# Altium schematic sheet CF_ADC.SchDoc
size Tabloid; DocumentNumber: 6; SheetNumber: 6; SheetTotal: 10; Sheet_Name: CF_ADC; Size: 11x17
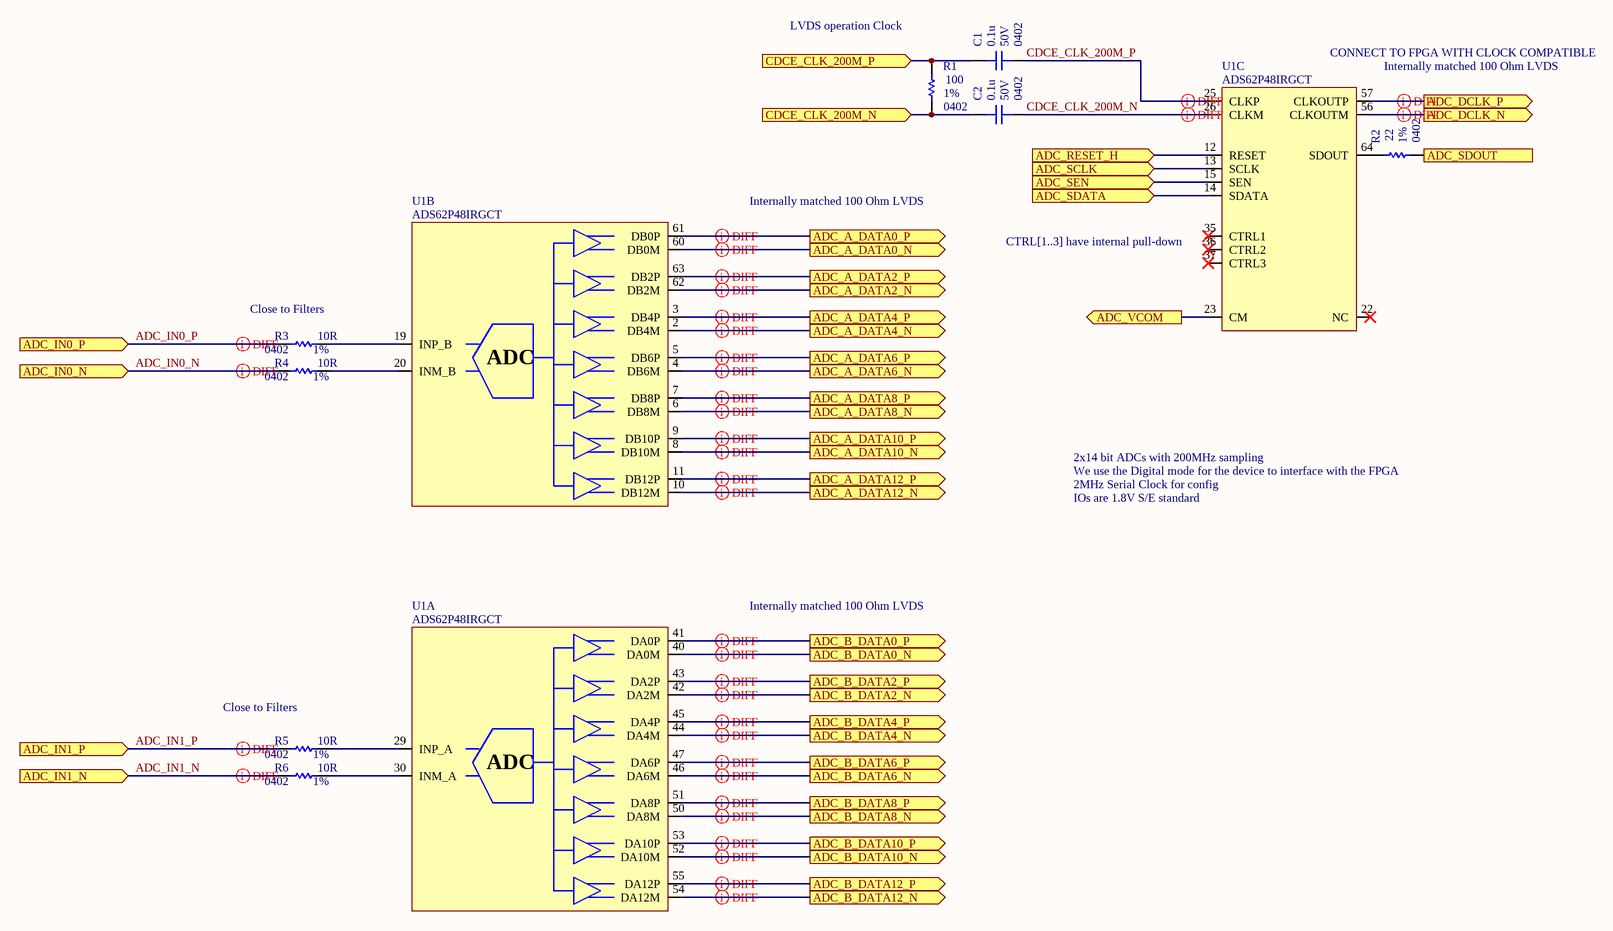
[diagram p0: CF_ADC.SchDoc]

## Parts
C1  value 0.1u  Voltage: 50V  Package: 0402  [CAP_0402]  (hidden comment: CAP - 0402)
C2  value 0.1u  Voltage: 50V  Package: 0402  [CAP_0402]  (hidden comment: CAP - 0402)
R1  value 100  Package: 0402  Precision: 1%  [RES_0402]  (hidden comment: RES - 0402)
R2  value 22  Package: 0402  Precision: 1%  [RES_0402]  (hidden comment: RES - 0402)
R3  value 10R  Package: 0402  Precision: 1%  [RES_0402]  (hidden comment: RES - 0402)
R4  value 10R  Package: 0402  Precision: 1%  [RES_0402]  (hidden comment: RES - 0402)
R5  value 10R  Package: 0402  Precision: 1%  [RES_0402]  (hidden comment: RES - 0402)
R6  value 10R  Package: 0402  Precision: 1%  [RES_0402]  (hidden comment: RES - 0402)
U1  ADS62P48IRGCT  [ADC_ADS62P48IRGCT]  (parts A,B,C of 4)

## Ports
ADC_A_DATA0_N (out), ADC_A_DATA0_P (out), ADC_A_DATA2_N (out), ADC_A_DATA2_P (out), ADC_A_DATA4_N (out), ADC_A_DATA4_P (out), ADC_A_DATA6_N (out), ADC_A_DATA6_P (out), ADC_A_DATA8_N (out), ADC_A_DATA8_P (out), ADC_A_DATA10_N (out), ADC_A_DATA10_P (out), ADC_A_DATA12_N (out), ADC_A_DATA12_P (out), ADC_B_DATA0_N (out), ADC_B_DATA0_P (out), ADC_B_DATA2_N (out), ADC_B_DATA2_P (out), ADC_B_DATA4_N (out), ADC_B_DATA4_P (out), ADC_B_DATA6_N (out), ADC_B_DATA6_P (out), ADC_B_DATA8_N (out), ADC_B_DATA8_P (out), ADC_B_DATA10_N (out), ADC_B_DATA10_P (out), ADC_B_DATA12_N (out), ADC_B_DATA12_P (out), ADC_DCLK_N (out), ADC_DCLK_P (out), ADC_IN0_N (in), ADC_IN0_P (in), ADC_IN1_N (in), ADC_IN1_P (in), ADC_RESET_H (in), ADC_SCLK (in), ADC_SDATA (in), ADC_SDOUT (out), ADC_SEN (in), ADC_VCOM (out), CDCE_CLK_200M_N (in), CDCE_CLK_200M_P (in)

## Nets
ADC_A_DATA0_N: U1.60(DB0M) ; port ADC_A_DATA0_N
ADC_A_DATA0_P: U1.61(DB0P) ; port ADC_A_DATA0_P
ADC_A_DATA2_N: U1.62(DB2M) ; port ADC_A_DATA2_N
ADC_A_DATA2_P: U1.63(DB2P) ; port ADC_A_DATA2_P
ADC_A_DATA4_N: U1.2(DB4M) ; port ADC_A_DATA4_N
ADC_A_DATA4_P: U1.3(DB4P) ; port ADC_A_DATA4_P
ADC_A_DATA6_N: U1.4(DB6M) ; port ADC_A_DATA6_N
ADC_A_DATA6_P: U1.5(DB6P) ; port ADC_A_DATA6_P
ADC_A_DATA8_N: U1.6(DB8M) ; port ADC_A_DATA8_N
ADC_A_DATA8_P: U1.7(DB8P) ; port ADC_A_DATA8_P
ADC_A_DATA10_N: U1.8(DB10M) ; port ADC_A_DATA10_N
ADC_A_DATA10_P: U1.9(DB10P) ; port ADC_A_DATA10_P
ADC_A_DATA12_N: U1.10(DB12M) ; port ADC_A_DATA12_N
ADC_A_DATA12_P: U1.11(DB12P) ; port ADC_A_DATA12_P
ADC_B_DATA0_N: U1.40(DA0M) ; port ADC_B_DATA0_N
ADC_B_DATA0_P: U1.41(DA0P) ; port ADC_B_DATA0_P
ADC_B_DATA2_N: U1.42(DA2M) ; port ADC_B_DATA2_N
ADC_B_DATA2_P: U1.43(DA2P) ; port ADC_B_DATA2_P
ADC_B_DATA4_N: U1.44(DA4M) ; port ADC_B_DATA4_N
ADC_B_DATA4_P: U1.45(DA4P) ; port ADC_B_DATA4_P
ADC_B_DATA6_N: U1.46(DA6M) ; port ADC_B_DATA6_N
ADC_B_DATA6_P: U1.47(DA6P) ; port ADC_B_DATA6_P
ADC_B_DATA8_N: U1.50(DA8M) ; port ADC_B_DATA8_N
ADC_B_DATA8_P: U1.51(DA8P) ; port ADC_B_DATA8_P
ADC_B_DATA10_N: U1.52(DA10M) ; port ADC_B_DATA10_N
ADC_B_DATA10_P: U1.53(DA10P) ; port ADC_B_DATA10_P
ADC_B_DATA12_N: U1.54(DA12M) ; port ADC_B_DATA12_N
ADC_B_DATA12_P: U1.55(DA12P) ; port ADC_B_DATA12_P
ADC_DCLK_N: U1.56(CLKOUTM) ; port ADC_DCLK_N
ADC_DCLK_P: U1.57(CLKOUTP) ; port ADC_DCLK_P
ADC_IN0_N: R4.2 ; port ADC_IN0_N
ADC_IN0_P: R3.2 ; port ADC_IN0_P
ADC_IN1_N: R6.2 ; port ADC_IN1_N
ADC_IN1_P: R5.2 ; port ADC_IN1_P
ADC_RESET_H: U1.12(RESET) ; port ADC_RESET_H
ADC_SCLK: U1.13(SCLK) ; port ADC_SCLK
ADC_SDATA: U1.14(SDATA) ; port ADC_SDATA
ADC_SDOUT: R2.1 ; port ADC_SDOUT
ADC_SEN: U1.15(SEN) ; port ADC_SEN
ADC_VCOM: U1.23(CM) ; port ADC_VCOM
CDCE_CLK_200M_N: C2.1 U1.26(CLKM)
CDCE_CLK_200M_N: C2.2 R1.1 ; port CDCE_CLK_200M_N  [a separate net that carries the same name]
CDCE_CLK_200M_P: C1.1 U1.25(CLKP)
CDCE_CLK_200M_P: C1.2 R1.2 ; port CDCE_CLK_200M_P  [a separate net that carries the same name]
NetR2_2: R2.2 U1.64(SDOUT)
NetR3_1: R3.1 U1.19(INP_B)
NetR4_1: R4.1 U1.20(INM_B)
NetR5_1: R5.1 U1.29(INP_A)
NetR6_1: R6.1 U1.30(INM_A)

Not connected (* = marked no-connect by the designer): U1 22(NC)* 35(CTRL1)* 36(CTRL2)* 37(CTRL3)*

## Layout directives
differential pair: ADC_A_DATA0_N, ADC_A_DATA0_P, ADC_A_DATA2_N, ADC_A_DATA2_P, ADC_A_DATA4_N, ADC_A_DATA4_P, ADC_A_DATA6_N, ADC_A_DATA6_P, ADC_A_DATA8_N, ADC_A_DATA8_P, ADC_A_DATA10_N, ADC_A_DATA10_P, ADC_A_DATA12_N, ADC_A_DATA12_P, ADC_B_DATA0_N, ADC_B_DATA0_P, ADC_B_DATA2_N, ADC_B_DATA2_P, ADC_B_DATA4_N, ADC_B_DATA4_P, ADC_B_DATA6_N, ADC_B_DATA6_P, ADC_B_DATA8_N, ADC_B_DATA8_P, ADC_B_DATA10_N, ADC_B_DATA10_P, ADC_B_DATA12_N, ADC_B_DATA12_P, ADC_DCLK_N, ADC_DCLK_P, ADC_IN0_N, ADC_IN0_P, ADC_IN1_N, ADC_IN1_P, CDCE_CLK_200M_N, CDCE_CLK_200M_P

## Notes on the sheet
- (near R1) LVDS operation Clock
- (near U1) CONNECT TO FPGA WITH CLOCK COMPATIBLE
- (near U1) Internally matched 100 Ohm LVDS
- Internally matched 100 Ohm LVDS
- (near U1) CTRL[1..3] have internal pull-down
- (near R3) Close to Filters
- 2x14 bit ADCs with 200MHz sampling
- We use the Digital mode for the device to interface with the FPGA
- IOs are 1.8V S/E standard
- 2MHz Serial Clock for config
- (near R5) Close to Filters
- Sheet Name
- Project Title
- Global Project
- Size
- Group
- Revision
- Date
- Sheet
- of
- Filename
- Designers
- (in symbol ADC_ADS62P48IRGCT, part A) ADC
- (in symbol ADC_ADS62P48IRGCT, part B) ADC

## Library data of the parts
C1 C2 = CAP - 0402: Precision: 10%; Current: *; CreatedBy: Jonathan Bouchard; Power: *
R1-R6 = RES - 0402: Voltage: 50V; Power: 1/16W; Current: *; CreatedBy: Jonathan Bouchard
U1 = ADC_ADS62P48IRGCT: ADC - 14 BIT 210MSPS SUAL - VQFN-64; Voltage: 3.15 V ~ 3.6 V / 1.7 V ~ 1.9 V; Mfg: Texas Instruments; Precision: 14 Bit; Current: *; Power: *; Mfg Part Number: ADS62P48IRGCT; HelpURL: http://www.ti.com/lit/ds/symlink/ads62p48.pdf; CreatedBy: Jonathan Bouchard; Temperature: -40°C ~ 85°C; Value: *; Package: VQFN-64; Supplier 1: Digikey; Supplier Part Number 1: 296-24611-1-ND